# EasyEDA schematic Cou Droit.json
TITLE: Sheet_1; REV: 1.0; Date: 2020-07-10; Sheet: 1/1; Company: Your Company
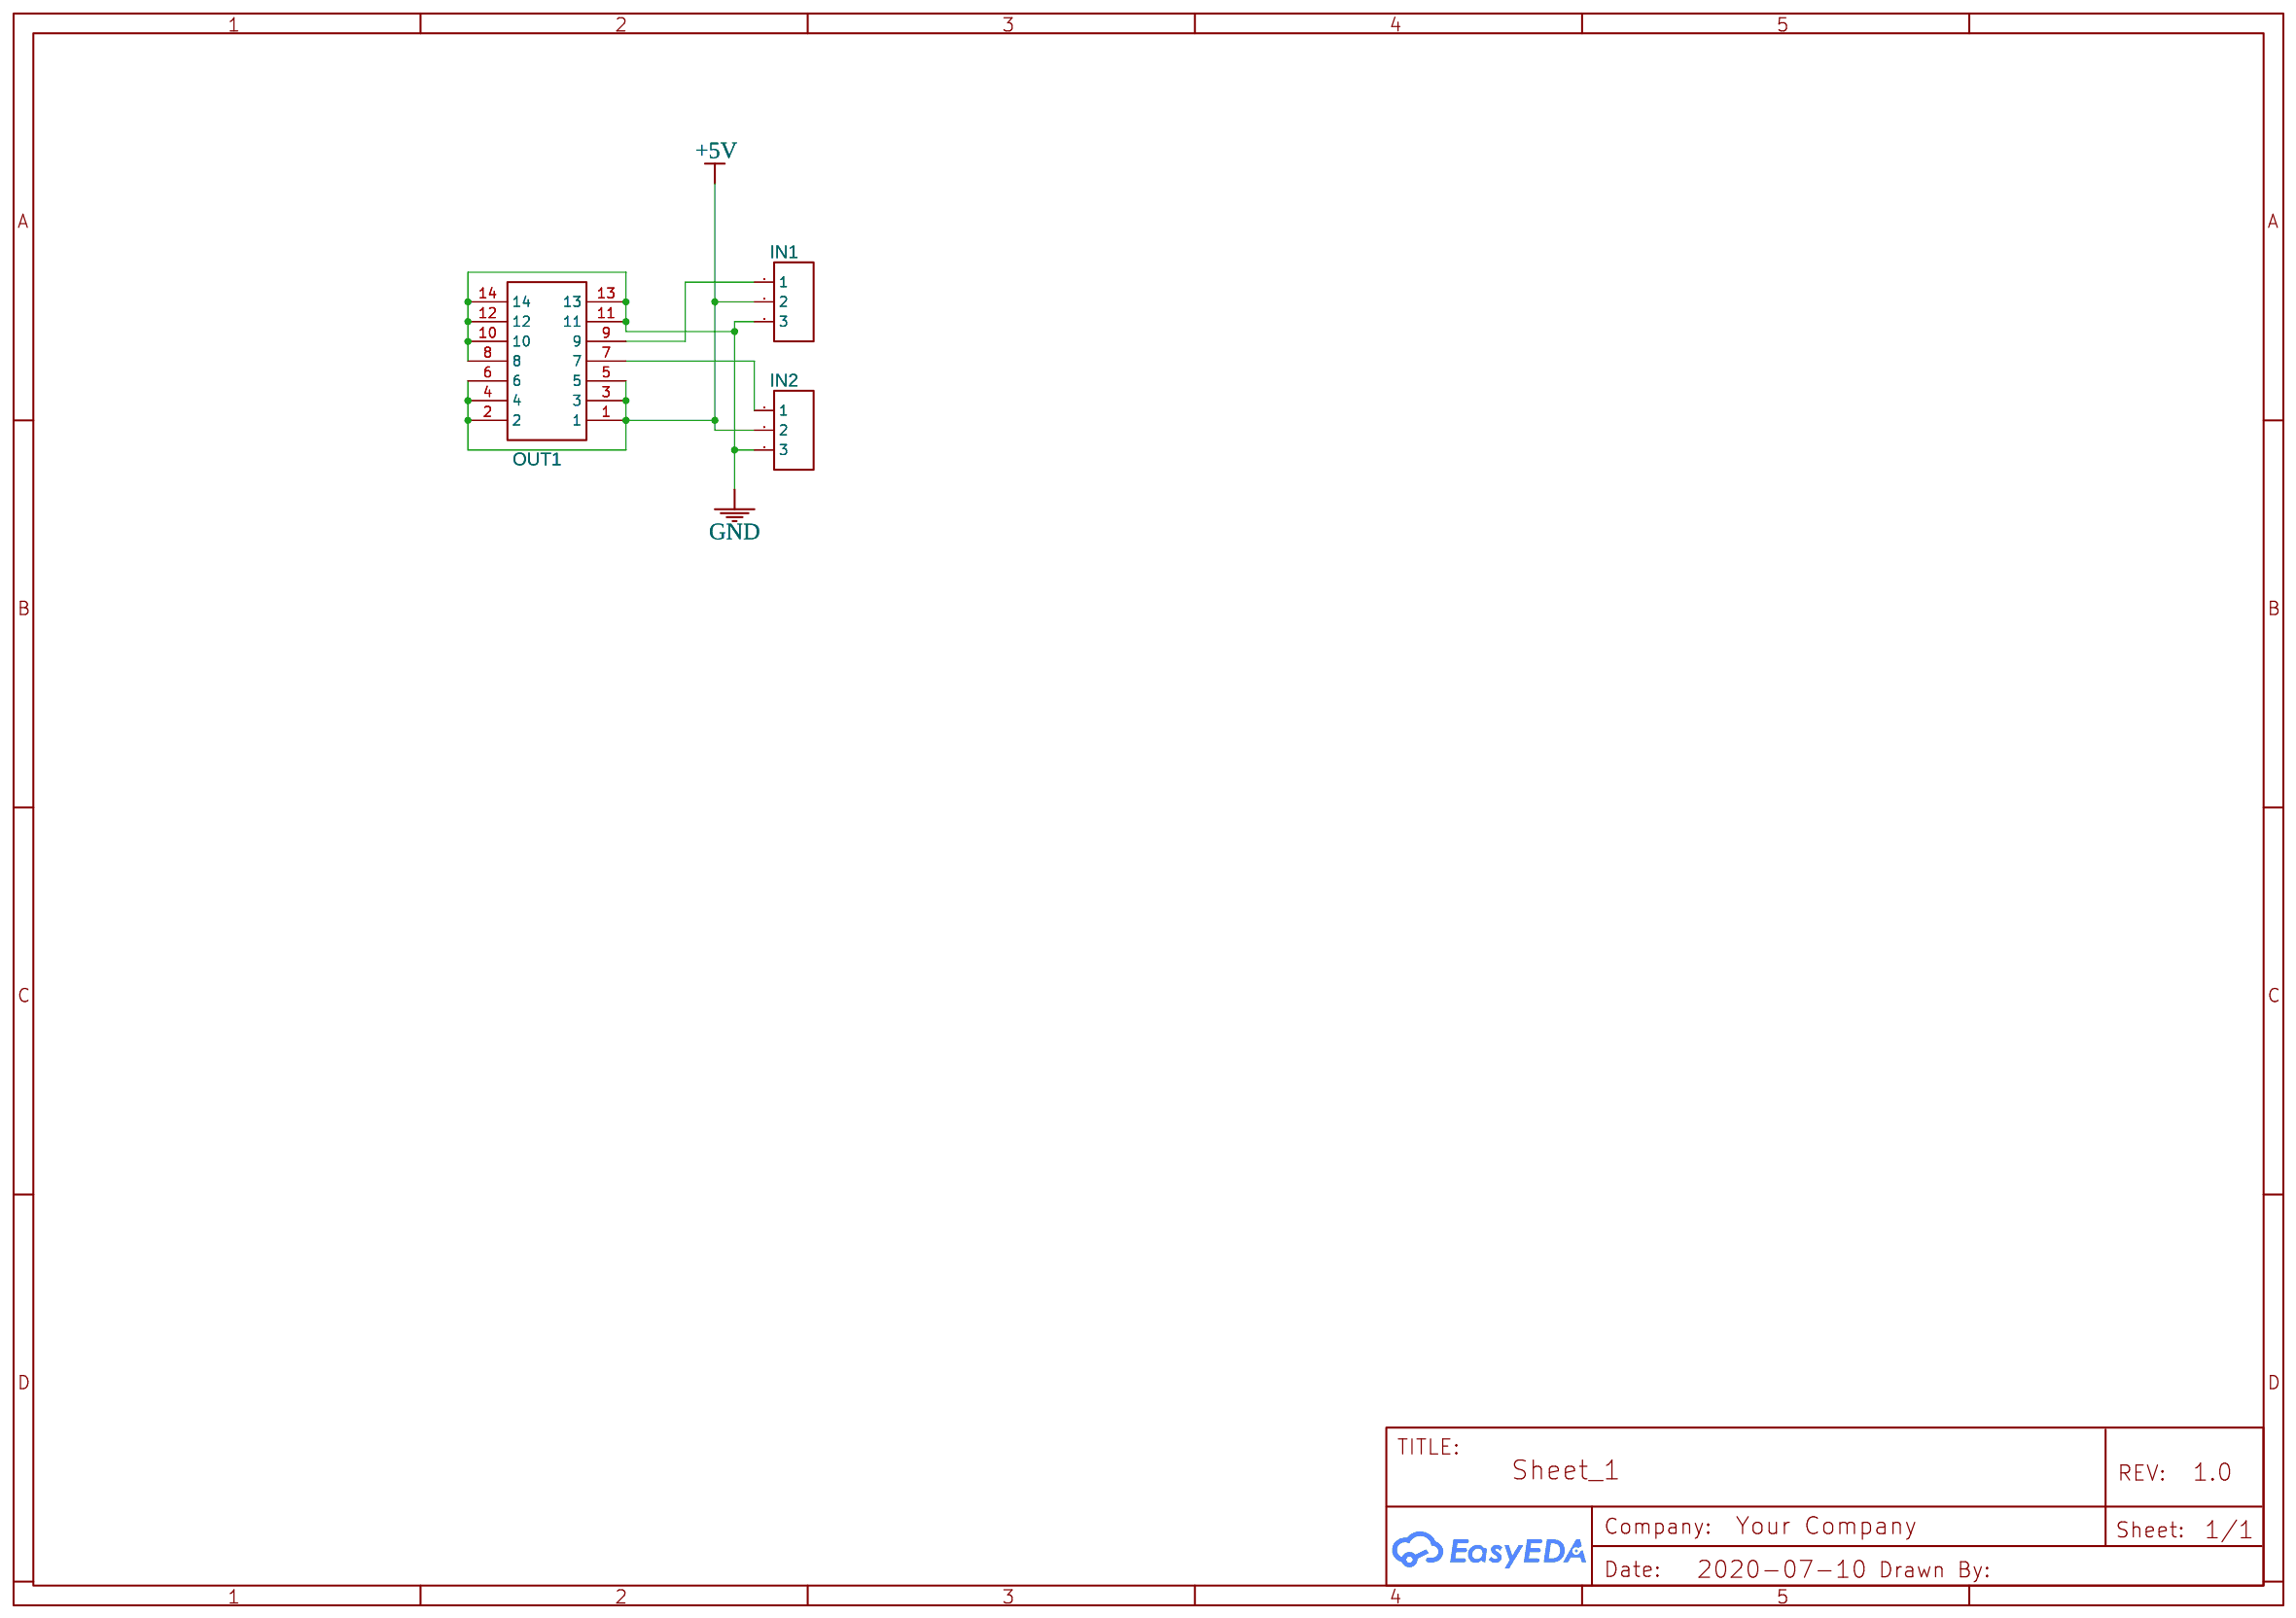
[diagram p0: schematic sheet]

## Parts
IN1  1  [HDR-TH_3P-P2.54-V]
IN2  1  [HDR-TH_3P-P2.54-V]
OUT1  Horn connector/2.0mm2*7P  [IDC-TH_14P-P2.00-V-M-R2-C7-S2.00]

## Library data of the parts
IN1 IN2 = Header-Male-2.54_1x3: Supplier: LCSC; Manufacturer: BOOMELE; Manufacturer Part: Header2.54mm 1*3P; image: //image.lceda.cn/szlcsc/C49257.jpg; Supplier Part: C49257
OUT1 = Horn connector/2.0mm2*7P: Supplier: LCSC; Manufacturer: BOOMELE; Manufacturer Part: Horn connector/2.0mm2*7P直简牛; Supplier Part: C29428

## Nets
+5V: IN1.2 IN2.2 OUT1.1 OUT1.2 OUT1.3 OUT1.4 OUT1.5 OUT1.6
GND: IN1.3 IN2.3 OUT1.8 OUT1.10 OUT1.11 OUT1.12 OUT1.13 OUT1.14
Net-(IN1-1): IN1.1 OUT1.9
Net-(IN2-1): IN2.1 OUT1.7
